# EAGLE design mini_controller_m328 (EAGLE 9.6.2)
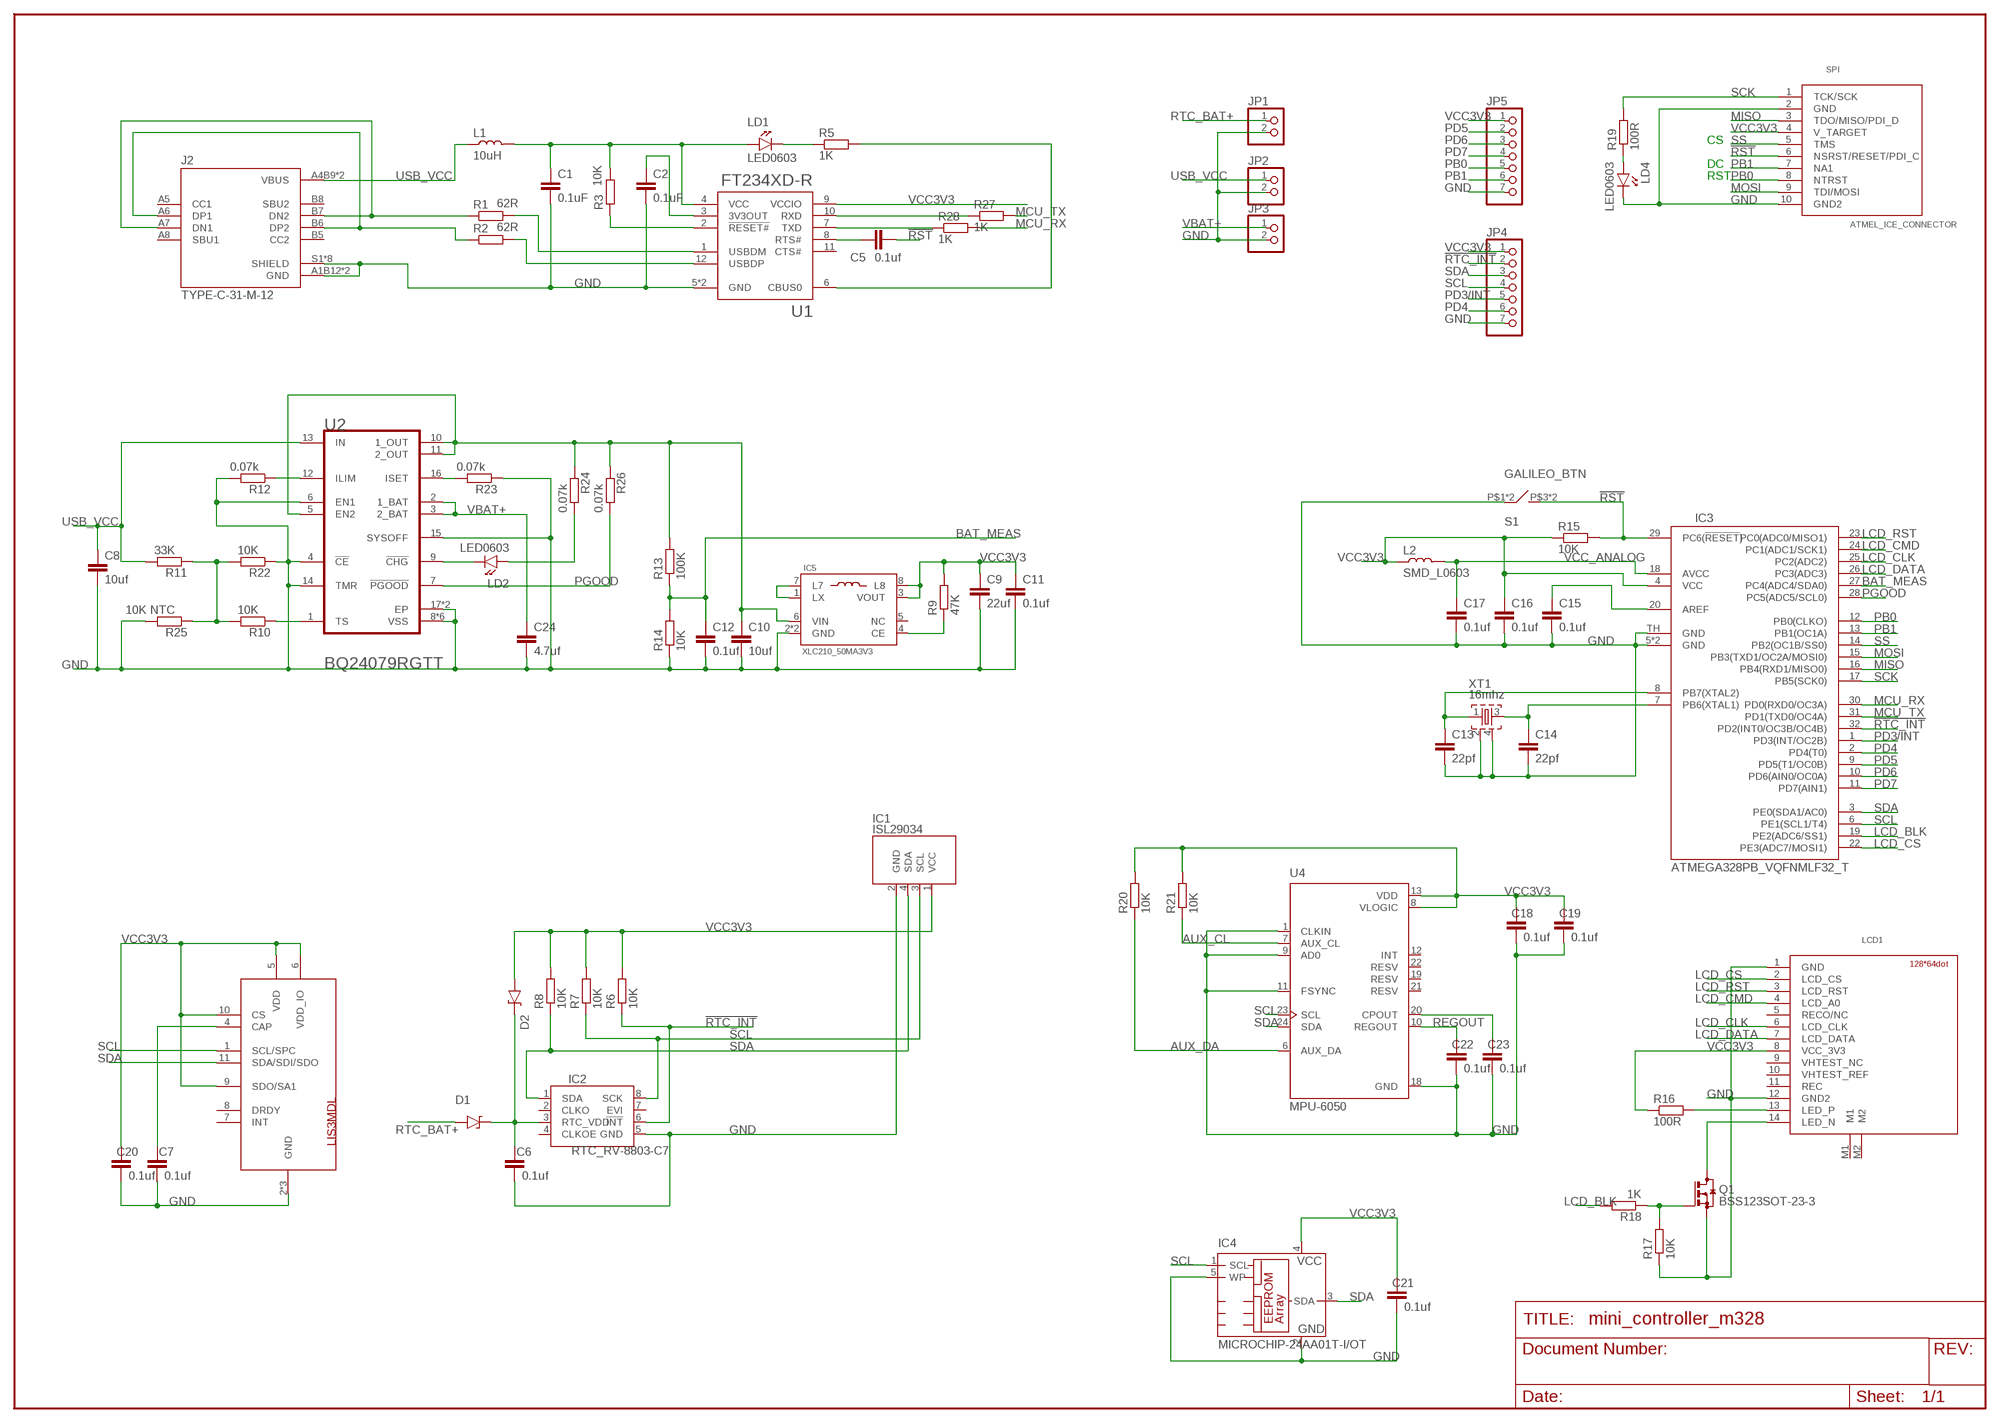
[diagram p0: schematic, sheet 1]

## Parts
C1  0.1uF  SMD_C0603  [0603]
C2  0.1uF  SMD_C0603  [0603]
C5  0.1uf  SMD_C0603  [0603]
C6  0.1uf  SMD_C0603  [0603]
C7  0.1uf  SMD_C0603  [0603]
C8  10uf  SMD_C1206  [1206]
C9  22uf  SMD_C0805  [0805]
C10  10uf  SMD_C0603  [0603]
C11  0.1uf  SMD_C0603  [0603]
C12  0.1uf  SMD_C0603  [0603]
C13  22pf  SMD_C0603  [0603]
C14  22pf  SMD_C0603  [0603]
C15  0.1uf  SMD_C0603  [0603]
C16  0.1uf  SMD_C0603  [0603]
C17  0.1uf  SMD_C0603  [0603]
C18  0.1uf  SMD_C0603  [0603]
C19  0.1uf  SMD_C0603  [0603]
C20  0.1uf  SMD_C0603  [0603]
C21  0.1uf  SMD_C0603  [0603]
C22  0.1uf  SMD_C0603  [0603]
C23  0.1uf  SMD_C0603  [0603]
C24  4.7uf  SMD_C0805  [0805]
D1  D_SOD323  [SOD-323_D]
D2  D_SOD323  [SOD-323_D]
IC1  ISL29034  [ISL29034]
IC2  RTC_RV-8803-C7  [C7_RTC]
IC3  ATMEGA328PB_VQFNMLF32_T  [MLF32-TH]
IC4  MICROCHIP-24AA01T-I/OT  [SOT-23(5)]
IC5  XLC210_50MA3V3  [XCL210_50MA3V3]
J2  TYPE-C-31-M-12  [HRO_TYPE-C-31-M-12]
JP1  PINHD-1X2  [1X02]
JP2  PINHD-1X2  [1X02]
JP3  PINHD-1X2  [1X02]
JP4  PINHD-1X7  [1X07]
JP5  PINHD-1X7  [1X07]
L1  10uH  SMD_L0603  [0603]
L2  SMD_L0603  [0603]
LCD1  ALE_LCD_128X64  [ALE_LCD_14PIN_CONNECTOR]
LD1  LED0603  [0603_P]
LD2  LED0603  [0603_P]
LD4  LED0603  [0603_P]
Q1  BSS123SOT-23-3  [SOT-23(3)]
R1  62R  SMD_R0603  [0603]
R2  62R  SMD_R0603  [0603]
R3  10K  SMD_R0603  [0603]
R5  1K  SMD_R0603  [0603]
R6  10K  SMD_R0603  [0603]
R7  10K  SMD_R0603  [0603]
R8  10K  SMD_R0603  [0603]
R9  47K  SMD_R0603  [0603]
R10  10K  SMD_R0603  [0603]
R11  33K  SMD_R0603  [0603]
R12  0.07k  SMD_R0603  [0603]
R13  100K  SMD_R0603  [0603]
R14  10K  SMD_R0603  [0603]
R15  10K  SMD_R0603  [0603]
R16  100R  SMD_R0603  [0603]
R17  10K  SMD_R0603  [0603]
R18  1K  SMD_R0603  [0603]
R19  100R  SMD_R0603  [0603]
R20  10K  SMD_R0603  [0603]
R21  10K  SMD_R0603  [0603]
R22  10K  SMD_R0603  [0603]
R23  0.07k  SMD_R0603  [0603]
R24  0.07k  SMD_R0603  [0603]
R25  10K NTC  SMD_R0603  [0603]
R26  0.07k  SMD_R0603  [0603]
R27  1K  SMD_R0603  [0603]
R28  1K  SMD_R0603  [0603]
S1  GALILEO_BTN  [GALILEO_VERT_BTN]
SPI  ATMEL_ICE_CONNECTOR  [MINI10P_SPI/JTAG/PDI]
U1  FT234XD-R  [IC_FT234XD-R]
U2  TEXAS_INSTRUMENTS_BQ24079RGTTTEXAS_INSTRUMENTS_BQ24079RGTT_0_0  [TEXAS_INSTRUMENTS_BQ24079RGTT_0]
U4  MPU-6050  [QFN50P400X400X95-24N]
U$1  LIS3MDL  [LGA-12]
XT1  16mhz  QUARTZ_ZQ  [QUARTZ_3X3MM]

## Nets
!RST: C5.2 IC3.29(PC6(!RESET!)) R15.2 S1.P$3 S1.P$4 SPI.6(NSRST/RESET/PDI_C)
!RTC_INT: IC2.6(!INT) IC3.32(PD2(INT0/OC3B/OC4B)) JP4.2 R6.1
AUX_CL: R21.1 U4.7(AUX_CL)
AUX_DA: R20.1 U4.6(AUX_DA)
BAT_MEAS: C12.1 IC3.27(PC4(ADC4/SDA0)) R13.1 R14.2
DM2: R1.2 U1.1(USBDM)
DP2: R2.2 U1.12(USBDP)
GND: C1.2 C2.2 C6.2 C7.2 C8.2 C9.2 C10.2 C11.2 C12.2 C13.2 C14.2 C15.2 C16.2 C17.2 C18.2 C19.2 C20.2 C21.2 C22.2 C23.2 C24.2 IC1.2(GND) IC2.5(GND) IC3.5(GND) IC3.21(GND) IC3.TH(GND) IC4.2(GND) IC4.5(WP) IC5.2(GND) IC5.9(GND) J2.A1B12(GND) J2.B1A12(GND) J2.S1(SHIELD) J2.S2(SHIELD) J2.S3(SHIELD) J2.S4(SHIELD) J2.S5(SHIELD) J2.S6(SHIELD) J2.S7(SHIELD) J2.S8(SHIELD) JP1.2 JP2.2 JP3.2 JP4.7 JP5.7 LCD1.1(GND) LCD1.12(GND2) LD4.1(K) Q1.2(S) R12.2 R14.1 R17.1 R22.1 R23.1 R25.2 S1.P$1 S1.P$2 SPI.2(GND) SPI.10(GND2) U1.5(GND) U1.13(GND) U2.4(!CE!) U2.6(EN1) U2.8(VSS) U2.14(TMR) U2.15(SYSOFF) U2.17(EP) U2.17-2(EP) U2.PAD_1(VSS) U2.PAD_2(VSS) U2.PAD_3(VSS) U2.PAD_4(VSS) U2.PAD_5(VSS) U4.1(CLKIN) U4.9(AD0) U4.11(FSYNC) U4.18(GND) U$1.2(GND) U$1.3(GND) U$1.12(GND) XT1.2 XT1.4
LCD_BLK: IC3.19(PE2(ADC6/SS1)) R18.2
LCD_CLK: IC3.25(PC2(ADC2)) LCD1.6(LCD_CLK)
LCD_CMD: IC3.24(PC1(ADC1/SCK1)) LCD1.4(LCD_A0)
LCD_CS: IC3.22(PE3(ADC7/MOSI1)) LCD1.2(LCD_CS)
LCD_DATA: IC3.26(PC3(ADC3)) LCD1.7(LCD_DATA)
LCD_RST: IC3.23(PC0(ADC0/MISO1)) LCD1.3(LCD_RST)
MCU_RX: IC3.30(PD0(RXD0/OC3A)) R28.2
MCU_TX: IC3.31(PD1(TXD0/OC4A)) R27.2
MISO: IC3.16(PB4(RXD1/MISO0)) SPI.3(TDO/MISO/PDI_D)
MOSI: IC3.15(PB3(TXD1/OC2A/MOSI0)) SPI.9(TDI/MOSI)
N$1: LCD1.13(LED_P) R16.2
N$2: LCD1.14(LED_N) Q1.3(D)
N$3: IC5.1(LX) IC5.7(L7)
N$4: Q1.1(G) R17.2 R18.1
N$5: IC5.4(CE) R9.1
N$6: R10.2 R11.1 R22.2 R25.1
N$7: C1.1 L1.2 LD1.2(A) R3.2 U1.4(VCC)
N$8: C13.1 IC3.8(PB7(XTAL2)) XT1.1
N$9: C2.1 U1.3(3V3OUT)
N$10: LD1.1(K) R5.1
N$11: R5.2 U1.6(CBUS0)
N$12: C14.1 IC3.7(PB6(XTAL1)) XT1.3
N$13: LD2.1(K) U2.9(!CHG!)
N$14: R27.1 U1.10(RXD)
N$15: C5.1 U1.8(RTS#)
N$16: LD4.2(A) R19.1
N$17: C23.1 U4.20(CPOUT)
N$18: R10.1 U2.1(TS)
N$19: C6.1 D1.K D2.K IC2.3(RTC_VDD)
N$20: C15.1 IC3.20(AREF)
N$21: J2.A7(DN1) J2.B7(DN2) R1.1
N$22: J2.A6(DP1) J2.B6(DP2) R2.1
N$23: R12.1 U2.12(ILIM)
N$24: C10.1 IC5.6(VIN) R13.2 R24.1 R26.1 U2.5(EN2) U2.10(1_OUT) U2.11(2_OUT)
N$25: LD2.2(A) R24.2
N$26: R23.2 U2.16(ISET)
N$27: R28.1 U1.7(TXD)
N$30: C7.1 U$1.4(CAP)
PB0: IC3.12(PB0(CLKO)) JP5.5 SPI.8(NTRST)
PB1: IC3.13(PB1(OC1A)) JP5.6 SPI.7(NA1)
PD3/INT: IC3.1(PD3(INT/OC2B)) JP4.5
PD4: IC3.2(PD4(T0)) JP4.6
PD5: IC3.9(PD5(T1/OC0B)) JP5.2
PD6: IC3.10(PD6(AIN0/OC0A)) JP5.3
PD7: IC3.11(PD7(AIN1)) JP5.4
PGOOD: IC3.28(PC5(ADC5/SCL0)) R26.2 U2.7(!PGOOD!)
REGOUT: C22.1 U4.10(REGOUT)
RTC_BAT+: D1.A JP1.1
SCK: IC3.17(PB5(SCK0)) R19.2 SPI.1(TCK/SCK)
SCL: IC1.3(SCL) IC2.8(SCK) IC3.6(PE1(SCL1/T4)) IC4.1(SCL) JP4.4 R7.1 U4.23(SCL) U$1.1(SCL/SPC)
SDA: IC1.4(SDA) IC2.1(SDA) IC3.3(PE0(SDA1/AC0)) IC4.3(SDA) JP4.3 R8.1 U4.24(SDA) U$1.11(SDA/SDI/SDO)
SER_RST: R3.1 U1.2(!RESET#)
SS: IC3.14(PB2(OC1B/SS0)) SPI.5(TMS)
USB_VCC: C8.1 J2.A4B9(VBUS) J2.B4A9(VBUS) JP2.1 L1.1 R11.2 U2.13(IN)
VBAT+: C24.1 JP3.1 U2.2(1_BAT) U2.3(2_BAT)
VCC3V3: C9.1 C11.1 C16.1 C18.1 C19.1 C20.1 C21.1 D2.A IC1.1(VCC) IC3.4(VCC) IC4.4(VCC) IC5.3(VOUT) IC5.8(L8) JP4.1 JP5.1 L2.1 LCD1.8(VCC_3V3) R6.2 R7.2 R8.2 R9.2 R15.1 R16.1 R20.2 R21.2 SPI.4(V_TARGET) U1.9(VCCIO) U4.8(VLOGIC) U4.13(VDD) U$1.5(VDD) U$1.6(VDD_IO) U$1.9(SDO/SA1) U$1.10(CS)
VCC_ANALOG: C17.1 IC3.18(AVCC) L2.2
Unconnected: IC2.2(CLKO) IC2.4(CLKOE) IC2.7(EVI) IC5.5(NC) J2.A5(CC1) J2.A8(SBU1) J2.B5(CC2) J2.B8(SBU2) LCD1.5(RECO/NC) LCD1.9(VHTEST_NC) LCD1.10(VHTEST_REF) LCD1.11(REC) LCD1.M1 LCD1.M2 U1.11(CTS#) U4.12(INT) U4.19(RESV) U4.21(RESV) U4.22(RESV) U$1.7(INT) U$1.8(DRDY)

## Notes on the sheet
- CS
- DC
- RST

## Library data of the parts
C1 C2 C5-C24 = passive_components:SMD_C
D1 D2 = rcl:D_SOD323
IC1 = my_IC:ISL29034
IC2 = my_IC:RTC_RV-8803-C7
IC3 = my_IC:ATMEGA328PB_VQFN
IC4 = my_IC:MICROCHIP-24AA01T-I/OT
IC5 = my_IC:XLC210_50MA3V3
J2 = TYPE-C-31-M-12:TYPE-C-31-M-12: USB Connectors 24 Receptacle 1 8.94*7.3mm RoHS Check availability <https://pricing.snapeda.com/parts/TYPE-C-31-M-12/HRO%20Electronics%20Co.%2C%20Ltd./view-part?ref=eda>; AVAILABILITY: In Stock; DESCRIPTION: USB Connectors 24 Receptacle 1 8.94*7.3mm RoHS; MF: HRO Electronics Co., Ltd.; MP: TYPE-C-31-M-12; PACKAGE: Package; PRICE: None
JP1-JP3 = pinhead:PINHD-1X2: PIN HEADER
JP4 JP5 = pinhead:PINHD-1X7: PIN HEADER
L1 L2 = passive_components:SMD_L
LCD1 = passive_components:ALE_LCD_128X64
LD1 LD2 LD4 = passive_components:LED
Q1 = passive_components:BSS123: N-CHANNEL MOS FET
R1-R3 R5-R28 = passive_components:SMD_R
S1 = passive_components:GALILEO_BTN
SPI = passive_components:ATMEL_ICE_CONNECTOR
U1 = my_IC:FT234XD-R: USB Bridge, USB to UART USB 2.0 UART Interface 12-DFN (3x3); AVAILABILITY: Unavailable; DESCRIPTION: USB Bridge, USB to UART USB 2.0 UART Interface 12-DFN (3x3); MF: FTDI,; MP: FT234XD-R; PACKAGE: DFN-12 FTDI; PRICE: None
U2 = my_IC:TEXAS_INSTRUMENTS_BQ24079RGTT: TI-BQ24079RGT16-1700X1700TP; CIIVA_IDS: 1417943; CODE__JEDEC: MO-220; DATASHEET: http://www.ti.com/general/docs/lit/getliterature.tsp?genericPartNumber=BQ24079&fileType=pdf; DATASHEET_VERSION: SLUS810G; FOOTPRINT_VARIANT_NAME_0: Manufacturer Recommended; IMPORTED: yes; IMPORTED_FROM: vault; IMPORT_TS: 1521862660; LEAD_ACID: N; LI__ION: N; LI__POLYMER: N; MF: Texas Instruments; MOUNTING_TECHNOLOGY: Surface Mount; MPN: BQ24079RGTT; NI_CD: N; NI_MH: N; OVER_VOLTAGE_PROTECTION: N; PACKAGE: RGT0016C; PACKAGE_DESCRIPTION: 16-Pin Plastic Quad Flat No-Lead, 3 x 3 mm Body, 0.5 mm Pitch, 1.7 x 1.7 mm Exposed Pad; PACKAGE_VERSION: revH, Oct-2011; PREFIX: U; RELEASE_DATE: 1464339317; ROHS: Yes; SUB_FAMILY: Battery Charge Management; VAULT_GUID: 48C01B46-D49D-4418-98EA-D573BDFB4E41; VAULT_REVISION: EF8F6D1C-9262-42B0-A6DA-E2A25455F509; VIN_MIN_V: 4.3
U4 = MPU-6050:MPU-6050: MPU-6050 Six-Axis (Gyro + Accelerometer) MEMS MotionTracking™ Devices Check availability <https://pricing.snapeda.com/parts/MPU-6050/TDK%20InvenSense/view-part?ref=eda>; AVAILABILITY: In Stock; DESCRIPTION: MPU-6050 series Accelerometer, Gyroscope, 3 Axis Sensor Evaluation Board; MF: TDK InvenSense; MP: MPU-6050; PACKAGE: VFQFN-24 TDK InvenSense; PRICE: None; PURCHASE-URL: https://pricing.snapeda.com/search/part/MPU-6050/?ref=eda
U$1 = LIS3MDL:LIS3MDL: Check availability <https://pricing.snapeda.com/parts/LIS3MDL/STMicroelectronics/view-part?ref=eda>; AVAILABILITY: In Stock; DESCRIPTION: Magnetoresistive Sensor X, Y, Z Axis 12-LGA (2x2); MF: STMicroelectronics; MP: LIS3MDL; PACKAGE: VFLGA-12 STMicroelectronics; PRICE: None; PURCHASE-URL: https://pricing.snapeda.com/search/part/LIS3MDL/?ref=eda
XT1 = passive_components:QUARTZ_ZQ

## Board
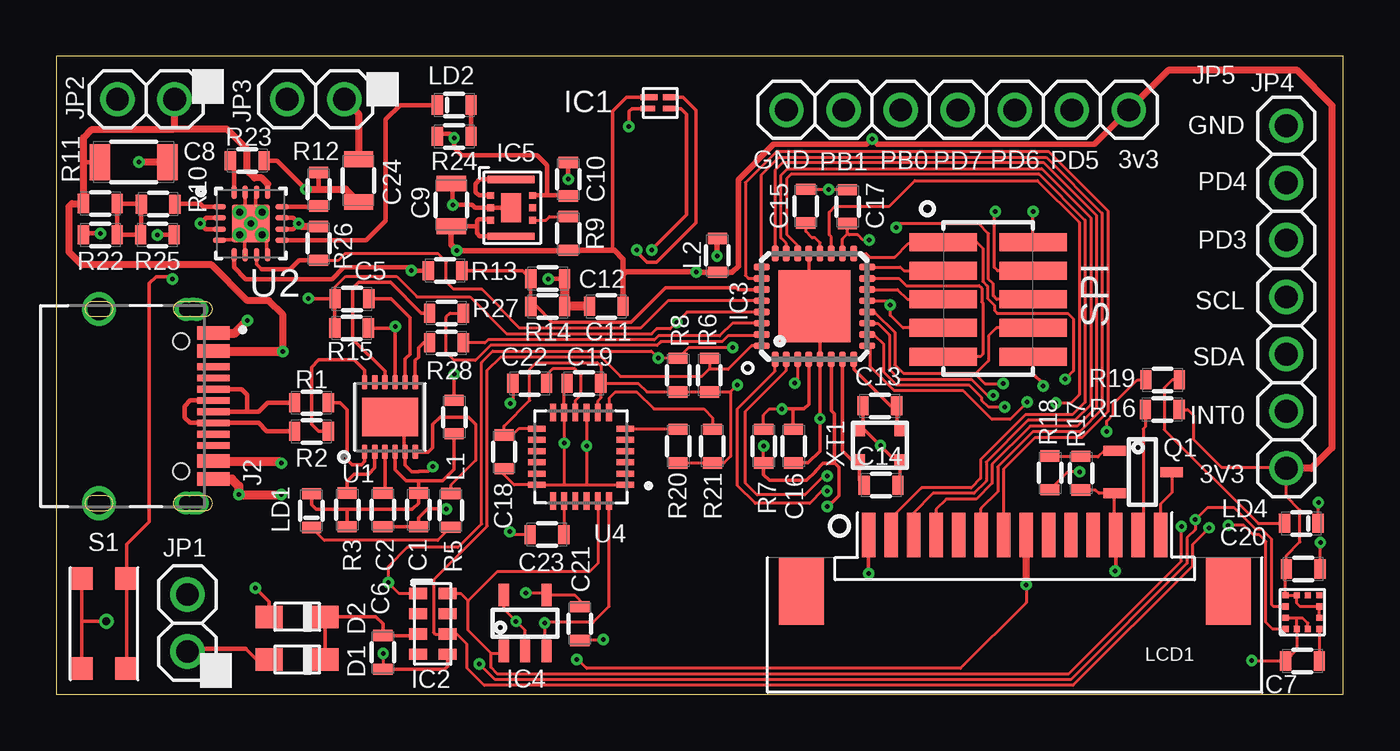
[diagram p1: board, top side]
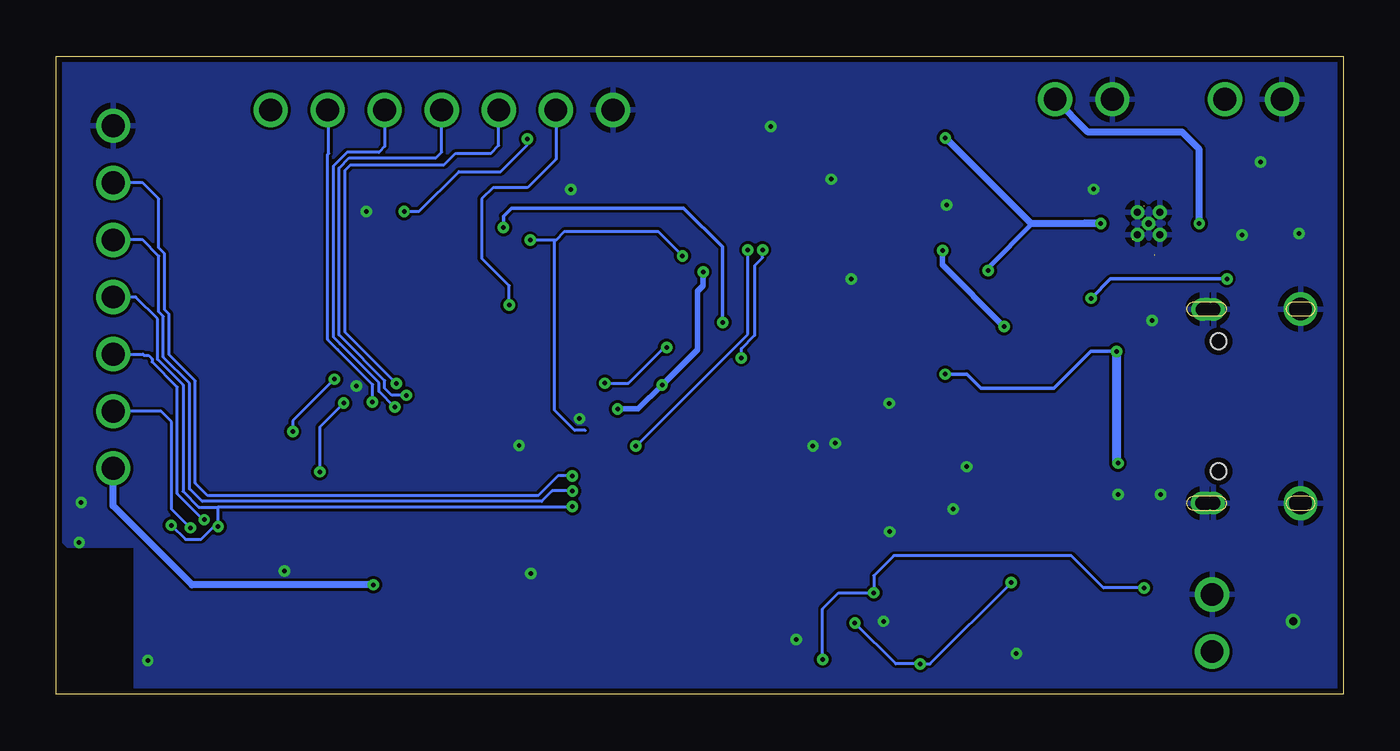
[diagram p2: board, bottom side, seen from below]

Size 57.3 x 28.4 mm. Coordinates in mm from the lower left corner, seen from the top.
Outline: 0,0 57.3,0 57.3,28.4 0,28.4 0,0
Copper layers (1*16): Top 0.035mm / dielectric 1.5mm / Bottom 0.035mm
Design rules "default *": minimum track width 5mil, minimum drill 0.2mm, track to track 5mil, track to pad 6mil, pad to pad 6mil, via to via 6mil, smd to smd 6mil, copper to edge 10mil, drill to drill 0.4mm, minimum pad ring 6mil, minimum via ring 6mil, stop-mask expansion 4mil, vias tented up to drill 20mil, thermal gap 10mil

### Footprints (pad centres in the part's own frame; a part is rotated, then mirrored left to right if it is on the bottom)
0603 = smd 0.85 x 0.5: 1 0,0.75; 2 0,-0.75
1206 = smd 1.6 x 0.9: 1 0,1.5; 2 0,-1.5
0805 = smd 1.3 x 0.7: 1 0,0.95; 2 0,-0.95
SOD-323_D = smd 1.2 x 1: A 1.25,0; K -1.25,0
ISL29034 = smd 0.75 x 0.25: 1 -0.5,0.25 | smd 0.65 x 0.25: 2 -0.55,-0.25; 3 0.45,-0.25; 4 0.45,0.25
C7_RTC = smd 0.8 x 0.5: 1 -0.65,1.35; 2 -0.65,0.45; 3 -0.65,-0.45; 4 -0.65,-1.35; 5 0.65,-1.35; 6 0.65,-0.45; 7 0.65,0.45; 8 0.65,1.35
MLF32-TH = smd 0.7 x 0.3: 1 -2.35,1.75; 2 -2.35,1.25; 3 -2.35,0.75; 4 -2.35,0.25; 5 -2.35,-0.25; 6 -2.35,-0.75; 7 -2.35,-1.25; 8 -2.35,-1.75; 17 2.35,-1.75; 18 2.35,-1.25; 19 2.35,-0.75; 20 2.35,-0.25; 21 2.35,0.25; 22 2.35,0.75; 23 2.35,1.25; 24 2.35,1.75 | smd 0.3 x 0.7: 9 -1.75,-2.35; 10 -1.25,-2.35; 11 -0.75,-2.35; 12 -0.25,-2.35; 13 0.25,-2.35; 14 0.75,-2.35; 15 1.25,-2.35; 16 1.75,-2.35; 25 1.75,2.35; 26 1.25,2.35; 27 0.75,2.35; 28 0.25,2.35; 29 -0.25,2.35; 30 -0.75,2.35; 31 -1.25,2.35; 32 -1.75,2.35 | smd 3.2 x 3.2: TH 0,0
SOT-23(5) = smd 0.45 x 1: 1 -0.95,-1.25; 2 0,-1.25; 3 0.95,-1.25; 4 0.95,1.25; 5 -0.95,1.25
XCL210_50MA3V3 = smd 0.3 x 0.3: 1 -0.92,0.55; 2 -0.92,0; 3 -0.92,-0.55; 4 0.95,-0.55; 5 0.95,0; 6 0.95,0.55 | smd 2.1 x 0.325: 7 0,1.262; 8 0,-1.262 | smd 0.9 x 1.3: 9 0,0
HRO_TYPE-C-31-M-12 = smd 0.6 x 1.45: A1B12 -3.25,5.095; A4B9 -2.45,5.095; B1A12 3.25,5.095; B4A9 2.45,5.095 | smd 0.3 x 1.45: A5 -1.25,5.095; A6 -0.25,5.095; A7 0.25,5.095; A8 1.25,5.095; B5 1.75,5.095; B6 0.75,5.095; B7 -0.75,5.095; B8 -1.75,5.095 | drill 0.6 pad 1: S1 -4.32,4.18; S2 4.32,4.18; S5 -4.31,3.87; S6 -4.31,4.37; S7 4.32,3.88; S8 4.32,4.38 | drill 1 pad 1.4: S3 -4.32,0; S4 4.32,0 | hole 0.7: -2.89,3.65; 2.89,3.65
1X02 = drill 1.016: 1 -1.27,0; 2 1.27,0
1X07 = drill 1.016: 1 -7.62,0; 2 -5.08,0; 3 -2.54,0; 4 0,0; 5 2.54,0; 6 5.08,0; 7 7.62,0
ALE_LCD_14PIN_CONNECTOR = smd 0.6 x 2: 1 6.5,-1; 2 5.5,-1; 3 4.5,-1; 4 3.5,-1; 5 2.5,-1; 6 1.5,-1; 7 0.5,-1; 8 -0.5,-1; 9 -1.5,-1; 10 -2.5,-1; 11 -3.5,-1; 12 -4.5,-1; 13 -5.5,-1; 14 -6.5,-1 | smd 2 x 3: M1 9.5,1.5; M2 -9.5,1.5
0603_P = smd 0.85 x 0.5: 1 0,0.75; 2 0,-0.75
SOT-23(3) = smd 0.45 x 1: 1 -0.95,-1.25; 2 0.95,-1.25; 3 0,1.29
GALILEO_VERT_BTN = smd 1 x 1: P$1 -2,1; P$2 2,1; P$3 -2,-1; P$4 2,-1
MINI10P_SPI/JTAG/PDI = smd 0.8 x 3: 1 0,-4; 2 0,0; 3 1.27,-4; 4 1.27,0; 5 2.54,-4; 6 2.54,0; 7 3.81,-4; 8 3.81,0; 9 5.08,-4; 10 5.08,0
IC_FT234XD-R = smd 0.65 x 0.25: 1 -1.55,1.125; 2 -1.55,0.675; 3 -1.55,0.225; 4 -1.55,-0.225; 5 -1.55,-0.675; 6 -1.55,-1.125; 7 1.55,-1.125; 8 1.55,-0.675; 9 1.55,-0.225; 10 1.55,0.225; 11 1.55,0.675; 12 1.55,1.125 | smd 1.7 x 2.5: 13 0,0
TEXAS_INSTRUMENTS_BQ24079RGTT_0 = smd 0.6 x 0.25: 1 -1.4,0.75; 2 -1.4,0.25; 3 -1.4,-0.25; 4 -1.4,-0.75; 9 1.4,-0.75; 10 1.4,-0.25; 11 1.4,0.25; 12 1.4,0.75 | smd 0.25 x 0.6: 5 -0.75,-1.4; 6 -0.25,-1.4; 7 0.25,-1.4; 8 0.75,-1.4; 13 0.75,1.4; 14 0.25,1.4; 15 -0.25,1.4; 16 -0.75,1.4 | smd 1.7 x 1.7: 17 0,0 | smd 1.55 x 1.55: 17-2 0,0 | drill 0.3 pad 0.5: PAD_1 0,0; PAD_2 0.5,-0.5; PAD_3 0.5,0.5; PAD_4 -0.5,0.5; PAD_5 -0.5,-0.5
QFN50P400X400X95-24N = smd 0.79 x 0.26: 1 -1.97,1.25; 2 -1.97,0.75; 3 -1.97,0.25; 4 -1.97,-0.25; 5 -1.97,-0.75; 6 -1.97,-1.25; 13 1.97,-1.25; 14 1.97,-0.75; 15 1.97,-0.25; 16 1.97,0.25; 17 1.97,0.75; 18 1.97,1.25 | smd 0.26 x 0.79: 7 -1.25,-1.97; 8 -0.75,-1.97; 9 -0.25,-1.97; 10 0.25,-1.97; 11 0.75,-1.97; 12 1.25,-1.97; 19 1.25,1.97; 20 0.75,1.97; 21 0.25,1.97; 22 -0.25,1.97; 23 -0.75,1.97; 24 -1.25,1.97
LGA-12 = smd 0.275 x 0.275: 1 -0.75,0.75; 2 -0.75,0.25; 3 -0.75,-0.25; 4 -0.75,-0.75; 5 -0.25,-0.75; 6 0.25,-0.75; 7 0.75,-0.75; 8 0.75,-0.25; 9 0.75,0.25; 10 0.75,0.75; 11 0.25,0.75; 12 -0.25,0.75
QUARTZ_3X3MM = smd 0.5 x 0.5: 1 -0.65,0.9; 2 0.65,0.9; 3 0.65,-0.9; 4 -0.65,-0.9

### Placement (x,y rotation side)
C1  16.13,8.22 0 top
C2  14.54,8.22 0 top
C5  13.17,17.6 270 top
C6  14.54,1.87 0 top
C7  55.48,1.48 270 top
C8  3.45,23.68 90 top
C9  17.59,21.78 180 top
C10  22.8,22.92 180 top
C11  24.49,17.27 270 top
C12  21.88,18.5 90 top
C13  36.67,12.84 270 top
C14  36.72,9.31 90 top
C15  33.37,21.73 180 top
C16  32.83,11.05 0 top
C17  35.23,21.71 180 top
C18  19.94,10.79 0 top
C19  23.5,13.84 270 top
C20  55.51,5.58 90 top
C21  23.31,3.15 0 top
C22  21.08,13.84 270 top
C23  21.84,7.11 270 top
C24  13.46,22.86 0 top
D1  10.73,1.55 180 top
D2  10.73,3.45 180 top
IC1  26.89,26.32 0 top
IC2  16.77,3.14 0 top
IC3  33.75,17.26 90 top
IC4  20.88,3.17 0 top
IC5  20.26,21.65 0 top
J2  1.91,12.83 270 top
JP1  5.84,3.17 90 top
JP2  4,26.48 180 top
JP3  11.56,26.48 180 top
JP4  54.76,17.68 90 top
JP5  40.14,26.01 180 top
L1  17.72,12.34 0 top
L2  29.44,19.54 180 top
LCD1  42.67,6.09 180 top
LD1  11.36,8.18 180 top
LD2  17.72,26.23 90 top
LD4  55.43,7.61 270 top
Q1  48.36,9.89 270 top
R1  11.37,12.98 90 top
R2  11.37,11.71 90 top
R3  12.96,8.22 0 top
R5  17.57,8.19 180 top
R6  29.08,14.21 0 top
R7  31.5,11.05 180 top
R8  27.68,14.21 0 top
R9  22.8,20.51 0 top
R10  4.54,21.81 270 top
R11  1.97,21.84 270 top
R12  11.68,22.48 180 top
R13  17.31,18.86 270 top
R14  21.88,17.26 270 top
R15  13.15,16.3 270 top
R16  49.24,12.68 270 top
R17  45.62,9.84 180 top
R18  44.24,9.86 0 top
R19  49.25,14 270 top
R20  27.69,11.05 0 top
R21  29.21,11.05 0 top
R22  1.97,20.45 90 top
R23  8.51,23.75 270 top
R24  17.72,24.83 90 top
R25  4.51,20.45 90 top
R26  11.68,20.07 0 top
R27  17.37,16.97 90 top
R28  17.37,15.65 90 top
S1  2.13,3.15 90 top
SPI  43.49,20.12 270 top
U1  14.86,12.34 90 top
U2  8.67,20.95 0 top
U4  23.36,10.57 180 top
U$1  55.47,3.66 90 top
XT1  36.66,11.09 270 top

### Tracks (layer width: path | path; a pad name or v marks a point on that pad's centre or on a via)
!RST  (via drill 0.2)
  Top 0.127: IC3.29 28.08,17.01 v27.62,16.55 | v37.39,20.78 37.55,20.93 41.08,20.93 41.5,20.51 41.5,18.48 41.71,18.27 41.71,17.73 41.87,17.57 SPI.6 | v27.62,16.55 | C5.2 12.42,18.13 12.89,18.61 15.14,18.61 16.07,17.68 18.41,17.68 20.05,16.05 26.51,16.05 26.73,16.27 27.33,16.27 v27.62,16.55
  Top 0.152: v5.18,18.49 5.08,18.59 4.45,18.59 4.15,18.3 4.15,7.69 3.13,6.67 S1.P$4 | v11.23,17.63 11.25,17.6 C5.2 12.4,17.59 R15.2 | S1.P$4 S1.P$3 | S1.P$4 3.27,5.28
  Bottom 0.152: v27.62,16.55 27.64,16.57 27.64,19.91 29.37,21.64 37.04,21.64 37.39,21.29 v37.39,20.78 | v5.18,18.49 10.36,18.49 v11.23,17.63
!RTC_INT  (via drill 0.2)
  Top 0.127: IC3.32 30.96,15.51 29.91,14.47 29.06,14.47 | v51.33,7.41 50.6,6.68 50.6,5.72 45.27,0.4 19.06,0.4 18.29,1.17 18.29,2.23 17.84,2.69 IC2.6 16.87,2.69 16.8,2.76 16.8,5.09 19.19,7.48 19.19,14.41 19.8,15.02 24.25,15.02 25.12,14.15 28.74,14.15 29.06,14.47 | R6.1 29.08,14.49 29.06,14.47
  Bottom 0.127: JP4.2 52.63,12.6 52.16,12.13 52.16,8.24 v51.33,7.41
AUX_CL
  Top 0.127: U4.7 24.64,12.57 24.64,13.21 24.89,13.46 25.84,13.46 26.61,12.7 28.83,12.7 29.21,12.32 R21.1
AUX_DA
  Top 0.127: U4.6 27.66,11.82 R20.1
BAT_MEAS
  Top 0.152: R13.1 20.77,18.86 C12.1 R14.2 | R14.2 21.08,17.26 | IC3.27 30.35,18.01 30.28,18.09 27.12,18.09 25.6,16.57 22.09,16.57 21.39,17.26 R14.2
DM2
  Top 0.152: U1.1 13.74,10.37 13.59,10.22 13.17,10.22 12.96,10.44 12.96,12.66 12.64,12.98 R1.2
DP2
  Top 0.152: R2.2 11.69,11.71 11.37,12.03 11.37,14.56 11.69,14.88 13.28,14.88 13.74,14.42 U1.12
GND  (via drill 0.2, 0.35)  (3 unrouted)
  Top 0.127: 34,12.17 v34,12.27 | LCD1.12 47.11,7.15 Q1.2 46.43,8.94 46.28,9.09 R17.1 | SPI.2 v43.48,21.49 | LD4.1 v56.18,8.53 v56.19,8.53 | v14.56,1.81 14.56,1.13 C6.2 | U$1.12 55.21,3.41 | 55.21,3.41 55.48,3.41 55.72,3.17 U$1.3 | 55.21,3.41 55.22,3.4 U$1.2 55.22,1.98 C7.2 53.25,1.48 v53.22,1.51 | C20.2 v56.26,6.75 v56.27,6.76 | IC4.2 20.88,2.85 v20.47,3.25 19.93,3.79 IC4.5 | v24.36,2.44 24.32,2.4 C21.2 | 22.61,9.32 U4.18 20.39,9.32 19.94,9.78 C18.2 | 22.61,9.32 23.62,9.32 | 23.62,9.32 U4.1 | 23.62,9.32 23.61,9.33 v23.61,11.05 U4.9 | 22.61,9.32 22.61,9.33 v22.61,11.18 U4.11 22.61,13.71 C19.2 | C22.2 20.33,13.49 20.35,13.48 20.35,13.08 v20.22,12.95 | C23.2 20.32,7.11 v20.19,7.24 | C15.2 v34.38,22.48 v34.39,22.47 C17.2
  Top 0.15: SPI.10 43.49,14.27 43.94,13.82 v43.94,13.72
  Top 0.152: U1.13 15.5,11.71 15.5,10.83 U1.5 15.54,10.2 15.81,9.92 16.14,9.92 16.16,9.93 16.56,9.93 v16.77,10.13 | C2.2 C1.2 16.13,7.86 16.53,8.25 v17.36,8.25 | C6.2 17.29,1.11 17.42,1.25 IC2.5 | 34,12.17 IC3.5 34,17.01 IC3.TH 33.5,17.51 IC3.21 | 35.62,11.9 XT1.4 | XT1.4 35.85,11.84 | 35.85,11.84 35.86,11.84 | SPI.2 43.28,20.11 | LCD1.1 v36.17,5.39 v36.17,5.38 | LCD1.12 47.17,5.51 v47.14,5.49 | S1.P$1 1.13,3.25 | 1.13,3.25 S1.P$2 | 1.13,3.25 v2.23,3.25 | C14.2 37.56,9.4 XT1.2 37.32,10.44 v36.69,11.07 36.02,11.74 XT1.4 | C13.2 35.92,11.9 35.85,11.84 | C16.2 33.48,10.3 34,10.83 v34,12.27 | U2.PAD_1 U2.PAD_4 8.42,21.7 U2.15 | U2.4 7.29,20.22 7.89,20.22 8.03,20.36 8.07,20.36 U2.PAD_5 8.4,20.22 8.4,19.57 | U2.6 8.4,19.57 | U2.8 9.37,19.61 9.37,20.22 | 9.37,20.26 U2.PAD_2 | U2.14 8.87,22.31 8.87,21.72 | 8.87,21.75 U2.PAD_3 | IC1.2 25.63,26.07 25.5,25.94 v25.5,25.27
  Top 0.2: R25.2 v4.51,20.45 | R22.1 1.28,20.51 v1.97,20.51 | R12.2 11.68,22.48 v11.11,22.48 9.84,23.75 R23.1 | IC5.9 IC5.2 18.64,21.65 18.51,21.78 v17.65,21.78 17.65,22.67 C9.2 | C12.2 21.93,18.5 v21.91,18.48 | C10.2 v22.8,22.92
  Top 0.305: v11.11,22.48 12.89,22.48 C24.2 | C8.2 v3.69,23.68 v3.68,23.69
  Top 0.406: C11.2 R14.1 C12.2 22.68,18.45 | J2.A1B12 7.95,16.08 v8.51,16.64 | J2.B1A12 7.82,9.58 8.13,9.27 v8.13,8.89 v10.03,8.89
  Bottom 0.356: JP5.7
  pour Bottom: 0.14,28.22 0.14,0.1 53.77,0.1 53.77,28.22
  pour Bottom: 51.55,28.22 57.06,28.22 57.21,28.07 57.21,7 56.8,6.59 51.55,6.59
LCD_BLK  (via drill 0.2)
  Top 0.127: v44.5,12.96 45.17,12.96 45.55,13.34 45.55,21 43.68,22.86 38.23,22.86 37.08,21.72 34.67,21.72 34.42,21.46 34.42,20.45 34.5,20.36 IC3.19 | v45.57,9.91 45.04,9.91 R18.2
  Bottom 0.127: v44.5,12.96 45.57,11.9 v45.57,9.91
LCD_CLK
  Top 0.127: LCD1.6 41.17,8.28 41.92,9.03 41.92,10.13 43.47,11.68 45.56,11.68 46.56,12.68 46.56,21.42 44.08,23.9 32.17,23.9 31.4,23.13 IC3.25
LCD_CMD
  Top 0.127: IC3.24 32,23.32 32.33,23.65 43.98,23.65 46.31,21.32 46.31,12.79 45.46,11.94 43.37,11.94 41.66,10.23 41.66,9.39 40.96,8.69 39.62,8.69 39.17,8.23 LCD1.4
LCD_CS
  Top 0.127: IC3.22 33,19.98 32.51,20.47 32.51,22.94 32.72,23.14 43.76,23.14 45.8,21.11 45.8,13 45.25,12.45 43.16,12.45 41.15,10.44 41.15,9.61 40.74,9.2 38.52,9.2 37.19,7.86 37.19,7.11 LCD1.2
LCD_DATA
  Top 0.127: LCD1.7 42.17,10.02 43.58,11.43 45.67,11.43 46.81,12.57 46.81,21.53 44.19,24.16 32.07,24.16 30.68,22.77 30.68,18.64 30.81,18.51 IC3.26
LCD_RST
  Top 0.127: IC3.23 32.5,20.07 32.26,20.32 32.26,23.09 32.56,23.39 43.87,23.39 46.05,21.21 46.05,12.89 45.35,12.19 43.26,12.19 41.41,10.34 41.41,9.49 40.86,8.94 39.04,8.94 38.15,8.05 38.15,7.11 LCD1.3
MCU_RX
  Top 0.127: IC3.30 30.1,16.51 29.54,15.95 26.8,15.95 26.63,15.78 19.23,15.78 19.09,15.65 R28.2
MCU_TX
  Top 0.127: IC3.31 31.35,15.96 29.91,15.96 29.64,15.7 26.92,15.7 26.84,15.62 | 26.84,15.62 26.83,15.62 | 26.84,15.62 26.75,15.53 19.33,15.53 18.66,14.86 17.72,14.86 17.37,15.21 17.37,16.8 17.54,16.97 R27.2
MISO
  Top 0.127: IC3.16 37.58,19.01 37.75,18.84 SPI.3
MOSI
  Top 0.127: IC3.15 37.52,18.51 37.84,18.19 41.08,18.19 41.2,18.07 41.2,17.47 41.25,17.42 41.25,15.14 41.15,15.04 SPI.9
N$1
  Top 0.127: R16.2 48.49,11.91 48.39,11.82 48.39,7.31 LCD1.13
  Top 0.305: 48.16,7.08 LCD1.13
N$2
  Top 0.127: LCD1.14 49.17,8.48 49.68,8.99 49.68,9.86 Q1.3
  Top 0.152: LCD1.14
N$3
  Top 0.2: IC5.1 18.82,22.2 18.67,22.35 18.67,22.73 18.85,22.92 IC5.7
N$4
  Top 0.127: Q1.1 46.66,10.84 46.38,10.57 45.64,10.57 R17.2 45.6,10.61 R18.1
N$5
  Top 0.127: IC5.4 21.8,21.1 21.96,21.26 R9.1
N$6
  Top 0.2: R22.2 R11.1 3.76,21.84 R10.2 3.79,20.48 R25.1 R22.2
N$7
  Top 0.152: U1.4 15.09,10 15.59,9.5 16.13,9.5 | 16.13,9.5 17.2,9.5 17.72,10.02 L1.2 | 16.13,9.5 C1.1 16.13,8.51 15.85,8.23 12.9,8.23 | LD1.2 11.38,8.91 11.38,8.43 11.58,8.23 12.9,8.23 | 12.9,8.23 12.96,8.18 R3.2
N$8
  Top 0.152: XT1.1 37.42,11.88 C13.1 37.13,12.84 35.5,14.47 IC3.8
N$9
  Top 0.152: U1.3 14.64,9.06 C2.1
N$10
  Top 0.127: R5.1 16.98,6.86 11.93,6.86 11.38,7.41
  Top 0.152: 11.38,7.41 LD1.1
N$11
  Top 0.127: 18.67,12.03 18.67,10.42 17.57,9.31 R5.2
  Top 0.152: U1.6 16.01,10.77 16.55,10.77 16.77,10.98 16.77,12.03 17.09,12.34 18.36,12.34 18.67,12.03
N$12
  Top 0.152: C14.1 35.76,9.52 XT1.3 35.41,10.44 35,10.84 IC3.7
N$13
  Top 0.2: U2.9 13.79,20.2 14.67,21.08 14.67,25.59 15.3,26.23 LD2.1
N$14
  Top 0.152: R27.1 16.26,16.97 14.88,18.34 13.46,18.34 13.2,18.08 13.2,15.81 14.64,14.37 U1.10
N$15
  Top 0.152: U1.8 15.54,14.93 15.75,15.14 15.75,16.76 14.91,17.6 C5.1
N$16
  Top 0.127: R19.1 49.69,14 49.33,13.64 49.33,11.79 53.5,7.61 LD4.2
N$17
  Top 0.127: U4.20 22.61,7.13 C23.1
N$18
  Top 0.2: U2.1 6.55,21.7 6.41,21.84 5.32,21.84 R10.1
N$19
  Top 0.152: D1.K D2.K 14.23,3.45 14.54,3.13 C6.1 16.05,2.62 IC2.3
N$20
  Top 0.127: IC3.20 34,20.1 33.78,20.32 33.66,20.32 33.37,20.61 C15.1
N$21
  Top 0.203: J2.A7 8.51,12.58 | 8.51,12.58 9.02,12.58 9.42,12.98 R1.1 | J2.B7 8.27,13.58 8.51,13.34 8.51,12.58
N$22
  Top 0.203: R2.1 9.37,11.71 9.01,12.08 J2.B6 5.96,12.08 5.71,12.32 5.71,12.83 5.97,13.08 J2.A6
N$23
  Top 0.2: U2.12 11.66,21.7 R12.1
N$24  (via drill 0.2)
  Top 0.2: U2.11 10.54,21.2 v10.79,20.95 10.54,20.7 U2.10 | R13.2 v15.81,18.86 15.67,19 12.81,19 12.29,18.48 8.45,18.48 7.92,19.01 U2.5 | R24.1 17.09,24.96 17.53,24.96 v17.72,24.77 17.72,24.32 18.05,23.98 21.4,23.98 21.84,23.54 21.84,22.2 IC5.6 22.77,22.2 C10.1
  Top 0.305: R26.1 10.93,20.82 v10.79,20.95
  Bottom 0.2: v10.79,20.95 13.84,20.95 15.81,18.99 v15.81,18.86
  Bottom 0.305: 11.56,20.95 v10.79,20.95 13.91,20.95 v17.72,24.77
N$25
  Top 0.2: LD2.2 R24.2
N$26
  Top 0.2: U2.16 7.92,23.59 R23.2
N$27
  Top 0.152: U1.7 15.99,14.86 16.14,15.01 16.14,15.43 16.36,15.65 R28.1
N$30
  Top 0.127: U$1.4 56.23,2.9 C7.1
PB0  (via drill 0.2)
  Top 0.127: IC3.12 36.43,17.01 37.34,16.11 37.34,14.66 37.72,14.29 40.88,14.29 40.92,14.25 | SPI.8 41.86,16.3 41.5,15.95 41.5,14.85 40.92,14.26 40.92,14.25 | 40.92,14.25 41.34,13.83 v42.15,13.83
  Bottom 0.127: JP5.5 37.59,24.43 37.95,24.08 39.52,24.08 40.03,23.56 44.2,23.56 44.45,23.31 44.45,16.13 v42.15,13.83
PB1  (via drill 0.2)
  Top 0.127: IC3.13 36.94,17.51 v37.13,17.32 37.13,16.87 37.7,16.3 SPI.7
  Top 0.152: IC3.13 36.14,17.47
  Bottom 0.127: v37.13,17.32 37.13,18.19 38.35,19.41 38.35,22.05 37.85,22.55 36.32,22.55 35.05,23.82 JP5.6
PD3/INT  (via drill 0.2)
  Top 0.127: v34.31,9.05 34.1,9.05 33.55,8.5 31.12,8.5 30.33,9.29 30.33,12.7 32,14.38 IC3.1
  Bottom 0.127: v34.31,9.05 35.22,9.05 35.69,8.59 50.8,8.59 51.36,9.15 51.36,13.84 52.53,15.01 52.53,16.82 52.73,17.02 52.73,19.51 53.45,20.22 JP4.5
PD4  (via drill 0.2)
  Top 0.127: IC3.2 32.5,14.42 30.68,12.6 30.68,9.4 31.2,8.88 33.33,8.88 34.17,9.72 v34.33,9.72
  Bottom 0.127: v34.33,9.72 34.96,9.72 35.84,8.84 50.55,8.84 51.1,9.4 51.1,13.95 52.27,15.12 52.27,16.92 52.48,17.13 52.48,19.61 52.73,19.87 52.73,22.05 53.45,22.76 JP4.6
PD5  (via drill 0.2)
  Top 0.127: IC3.9 36.22,15.4 36.22,14.6 37.3,13.52 40.38,13.52 41.66,12.24 42.47,12.24 v43.23,13.01
  Bottom 0.127: v43.23,13.01 43.21,13.03 43.21,13.79 44.76,15.34 44.77,15.34 45.21,15.79 45.21,24.03 45.16,24.08 45.16,25.95 JP5.2
PD6  (via drill 0.2)
  Top 0.127: IC3.10 36.41,16.01 36.83,15.6 36.83,14.35 37.41,13.78 40.63,13.78 41.2,13.21 41.2,13.1 41.5,12.79 v42.22,12.79 v42.23,12.79
  Bottom 0.127: JP5.3 42.67,24.38 42.93,24.12 44.35,24.12 44.96,23.52 44.96,16.61 44.96,15.89 44.66,15.6 42.93,13.87 42.93,13.48 v42.23,12.79
PD7  (via drill 0.2)
  Top 0.127: IC3.11 36.57,16.51 37.08,16 37.08,14.46 37.51,14.03 40.74,14.03 41.46,13.31 v41.72,13.31
  Bottom 0.127: JP5.4 40.13,24.13 40.39,23.87 44.25,23.87 44.7,23.41 44.7,16.05 44.7,16 44.55,15.85 42.67,13.97 42.67,13.62 42.36,13.31 v41.72,13.31
PGOOD
  Top 0.127: IC3.28 27.23,17.51 26.02,16.3 20.62,16.3 19.8,17.13 19.8,17.19 18.95,18.03 17.68,18.03 17.37,18.35 17.37,19.24 17,19.61 12.84,19.61 12.54,19.3 11.7,19.3 R26.2
  Top 0.152: 9.14,18.92 8.92,19.15 U2.7
  Top 0.2: R26.2 10.81,19.32 10.41,18.92 9.14,18.92
REGOUT
  Top 0.127: U4.10 23.11,13.08 23.37,13.34 23.37,14.22 23.11,14.48 22.1,14.48 21.83,14.21 C22.1
RTC_BAT+
  Top 0.152: D1.A 8.92,1.55 8.43,2.03
  Top 0.203: 8.43,2.03 5.97,2.03 JP1.1
SCK  (via drill 0.2)
  Top 0.127: 35.6,19.71 IC3.17 36.06,19.61 36.22,19.46 37.34,19.46 37.95,20.07 39.44,20.07 SPI.1 41,20.11 41.25,19.86 41.25,18.38 41.46,18.17 41.46,17.62 41.77,17.31 41.77,17.09 41.9,16.96 45.04,16.96 45.29,16.71 45.29,14.4 v44.91,14.02 | 48.57,13.93 R19.2 48.14,14 47.07,12.93 47.07,12.47 46.76,12.16 v46.76,11.7
  Bottom 0.127: v44.91,14.02 46.76,12.18 v46.76,11.7
SCL  (via drill 0.2)
  Top 0.127: v50.09,7.47 50.09,5.93 45.06,0.91 19.64,0.91 19.35,1.2 19.35,1.83 | IC2.8 18.02,4.49 18.34,4.17 | 19.35,1.83 18.34,2.85 18.34,4.17 | U$1.1 54.16,2.91 53.86,3.21 53.86,6.8 53.56,7.1 53.29,7.1 52.87,7.52 v52.18,7.52 | 19.35,1.83 19.84,1.83 IC4.1 | U4.23 24.11,5.83 23.75,5.46 19.63,5.46 18.34,4.17 | R7.1 v31.5,11.05
  Top 0.152: IC3.6 34.5,12.62 34.64,12.49 34.64,10.32 34.67,10.29 | v34.32,8.36 34.48,8.52 34.54,8.52 34.86,8.84 34.86,10.1 34.67,10.29 | R7.1 31.5,9.78 31.75,9.53 33.4,9.53 33.79,9.92 33.79,9.94 34.14,10.29 34.67,10.29 | IC1.3 27.81,26.07 28.07,25.81 28.07,21.34 v26.51,19.78
  Bottom 0.127: v34.32,8.36 34.32,8.33 50.09,8.33 | JP4.4 53.75,17.68 52.78,16.71 52.78,14.91 51.65,13.78 51.65,9.03 50.95,8.33 50.09,8.33 | 50.09,8.33 v50.09,7.47 50.28,7.47 50.85,6.89 51.55,6.89 v52.18,7.52 | v31.5,11.05 26.51,16.03 v26.51,19.78
SDA  (via drill 0.2)
  Top 0.127: IC3.3 33,13.98 v32.87,13.85 | v18.83,1.36 19.54,0.65 45.16,0.65 50.34,5.83 50.34,6.96 50.71,7.33 v50.71,7.77 51.23,8.3 52.45,8.3 53.4,7.35 53.67,7.35 54.11,6.91 54.11,4 54.2,3.91 U$1.11 | 16.1,4.47 IC2.1 15.28,4.49 v14.78,4.98 14.78,5.69 15.63,6.54 17.89,6.54 18.94,7.59 18.94,14.77 19.44,15.27 26.5,15.27 v26.8,14.97 26.81,14.96 R8.1 28.17,15.44 v30.12,15.44 | IC4.3 21.74,2.01 v21.74,3.17 21.77,3.21 23.91,3.21 24.61,3.91 U4.24
  Top 0.152: IC1.4 27.91,26.57 28.48,26 28.48,20.99 27.01,19.51 27.02,19.51 26.73,19.23 26.31,19.23 25.98,19.56 25.98,19.66 v25.85,19.78
  Bottom 0.127: v32.87,13.85 31.82,13.85 30.23,15.44 v30.12,15.44 | JP4.3 53.45,15.14 53.39,15.09 53.19,15.09 53.03,14.94 53.03,14.8 51.91,13.67 51.91,8.93 50.75,7.77 v50.71,7.77 | v14.78,4.98 18.4,1.36 v18.83,1.36 19.93,1.36 v21.74,3.17 | v26.8,14.97 26.8,15.39 26.2,15.98 26.2,19.08 25.85,19.43 v25.85,19.78
SER_RST
  Top 0.152: U1.2 14.19,10.08 13.91,9.8 13.28,9.8 12.96,9.48 R3.1
SS
  Top 0.127: IC3.14 37.46,18.01 37.9,17.57 SPI.5
USB_VCC  (via drill 0.2)
  Top 0.152: L1.1 v17.72,14.25
  Top 0.2: U2.13 9.42,22.71 | 9.39,22.75 9.29,22.84 | C8.1 1.22,23.68 1.22,23.69
  Top 0.305: v10.1,15.26 10.1,16.89 9.46,17.53 8.51,17.53 6.92,19.11 1.14,19.11 0.57,19.68 0.57,21.72 0.7,21.84 R11.2 1.22,23.69 1.22,24.78 1.59,25.15 5.21,25.15 | 5.21,25.15 5.27,25.21 JP2.1 | 9.42,22.71 9.39,22.75 9.14,22.99 8.83,22.99 8.51,23.3 8.51,24.26 7.62,25.15 5.21,25.15
  Top 0.406: J2.A4B9 10.09,15.28 v10.1,15.26 | v10.03,10.29 9.97,10.35 7.03,10.35 J2.B4A9
  Bottom 0.152: v17.72,14.25 16.77,14.25 16.13,13.61 12.89,13.61 11.24,15.26 v10.1,15.26
  Bottom 0.406: v10.1,15.26 10.1,10.35 v10.03,10.29
VBAT+  (via drill 0.2)
  Top 0.203: U2.2 6.67,21.2 6.67,21.21 v6.41,20.95 6.66,20.7 U2.3
  Top 0.305: JP3.1 13.46,25.84 C24.1
  Bottom 0.305: v6.41,20.95 6.41,24.26 7.18,25.02 11.37,25.02 JP3.1
VCC3V3  (via drill 0.2)
  Top 0.127: SPI.4 41.91,18.84 41.76,19 41.76,21.44 v41.81,21.49 | R16.1 50.37,12.68 50.62,12.42 50.62,11.36 51.87,10.11 54.72,10.11 JP4.1 | 30.02,13.46 R6.2 R8.2 26.29,13.46 25.91,13.84 C19.1 | 30.02,13.46 v30.33,13.77 | R7.2 31.5,12.44 31.76,12.7 v32.31,12.7 | U$1.5 U$1.6 55.38,3.91 55.38,3.9 55.22,4.06 U$1.9 U$1.10 54.72,5.54 C20.1 54.76,6.17 55.37,6.78 55.37,8.2 54.76,8.81 JP4.1 | IC4.4 21.87,4.42 | 21.87,4.42 23.07,4.42 23.31,4.18 C21.1 | v20.9,4.52 21.77,4.52 21.87,4.42 | U4.13 20.59,11.82 20.31,11.54 C18.1 19.94,11.94 21.08,13.08 21.08,14.48 21.37,14.76 24.1,14.76 24.26,14.61 24.26,13.86 C19.1 | U4.8 24.11,13.06 24.26,13.21 C19.1 | R20.2 R21.2 29.73,10.3 30.02,10.59 30.02,13.46 | v43.18,4.88 43.18,4.08 40.26,1.16 23.62,1.16 23.59,1.19 | 23.59,1.19 | 23.59,1.19 23.23,1.56 v23.18,1.56
  Top 0.152: U1.9 15.09,16.37 | 15.09,16.37 v15.1,16.37 | D2.A 9.48,4.12 v8.87,4.74 | IC3.4 33.5,12.91 33.29,12.7 32.8,12.7 | SPI.4 42.21,18.84 | JP4.1 | R15.1 15.02,16.3 15.09,16.37 | v32.31,12.7 32.8,12.7 | C16.1 32.8,11.83 32.8,12.7 | IC1.1 25.4,26.57 24.77,25.94 24.77,19.79 24.8,19.76
  Top 0.2: IC5.8 18.85,20.39 18.73,20.51 18.73,20.83 | 18.73,20.83 18.73,21.08 18.8,21.14 19.29,21.14 IC5.3 | C9.1 18.73,20.83
  Top 0.254: C9.1 17.59,20 v17.84,19.75 | v17.84,19.75 17.94,19.65 | v17.84,19.75 22.79,19.75 R9.2 24.8,19.76 24.85,19.76 25.24,19.37 25.24,18.7 | C11.1 25.24,18.7 | 25.24,18.7 25.34,18.8 v28.5,18.8 28.66,18.8 28.68,18.79 L2.1 30.09,18.79 30.37,19.06 30.37,22.9 31.93,24.47 36.08,24.47 v36.32,24.71 36.56,24.47 46.22,24.47 JP5.1
  Top 0.305: v43.18,4.88 LCD1.8 | JP5.1 49.53,27.79 55.22,27.79 56.79,26.21 56.79,10.97 55.88,10.06 JP4.1
  Bottom 0.127: v41.81,21.49 41.15,21.49 39.37,23.27 37.52,23.27 36.32,24.46 v36.32,24.71 | v8.87,4.74 10.68,4.74 12.12,6.17 20.02,6.17 20.9,5.28 v20.9,4.52 22.47,4.52 23.18,3.81 v23.18,1.56
  Bottom 0.254: v28.5,18.8 28.5,18.19 28.75,17.93 28.75,15.34 v30.33,13.77 31.39,12.7 v32.31,12.7 | v15.1,16.37 17.84,19.11 v17.84,19.75
  Bottom 0.305: v43.18,4.88 51.25,4.88 54.76,8.39 JP4.1
VCC_ANALOG  (via drill 0.2)
  Top 0.127: v36.2,20.22 35.92,20.22 35.69,20.45 35.31,20.45 35.24,20.51 | 35.24,20.51 35.23,20.52 C17.1 | IC3.18 35,20.27 35.24,20.51
  Top 0.254: v29.42,19.51 29.42,20.27 L2.2
  Bottom 0.127: v29.42,19.51 30.5,20.6 34.67,20.6 35.05,20.22 | 33.75,11.75 34.22,11.75 35.1,12.63 35.1,20.17 35.05,20.22 | 35.05,20.22 v36.2,20.22 35.26,20.22

### Text on the board
tNames: GND | GND | PB1 | PB0 | PD7 | PD6 | PD5 | 3v3 | PD4 | PD3 | SCL | SDA | INT0 | 3V3